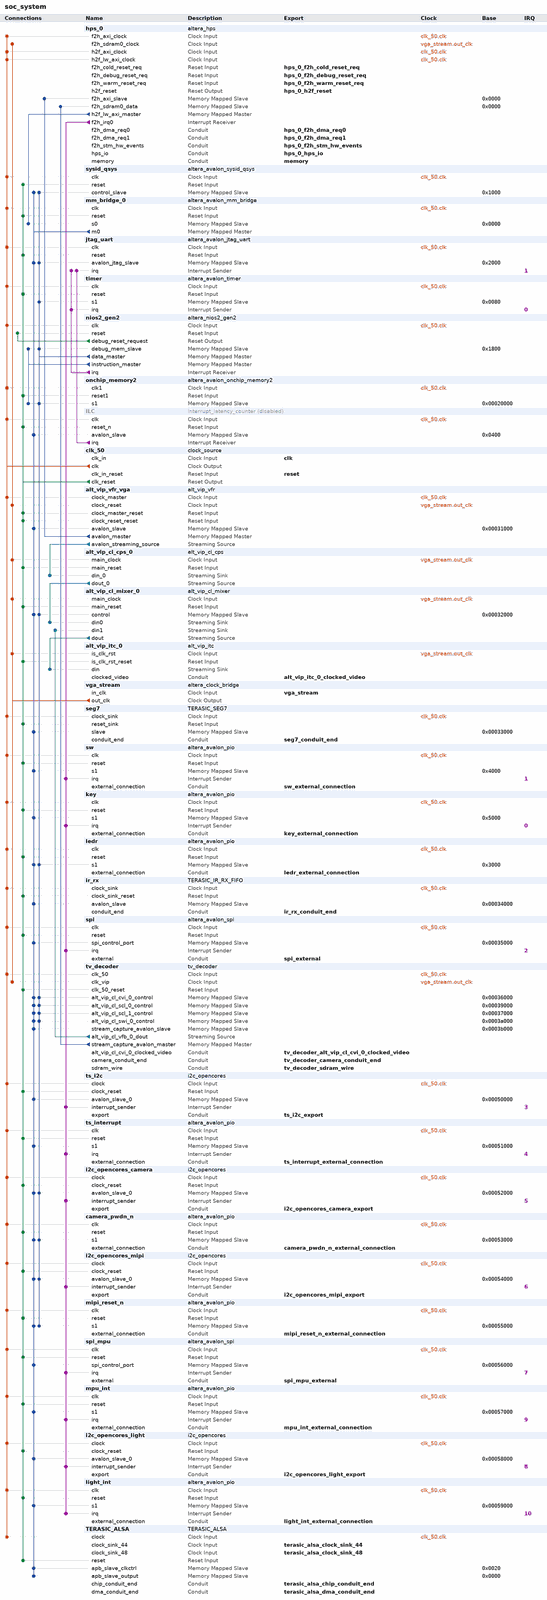
[diagram p0: system contents, whole]
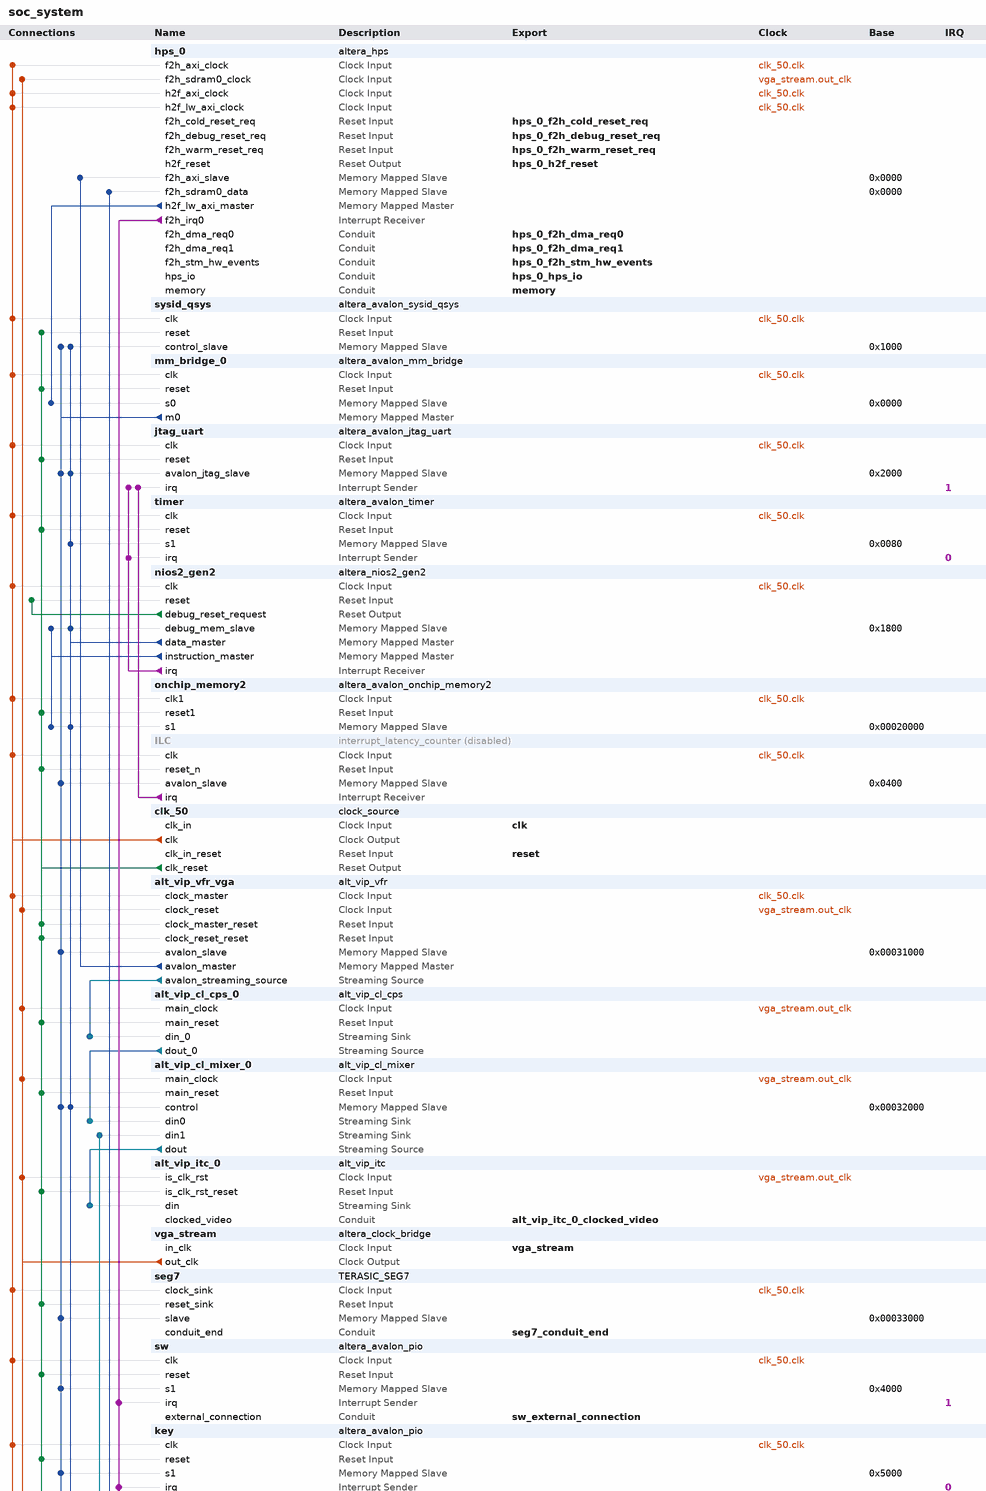
[diagram p1: system contents, upper part]
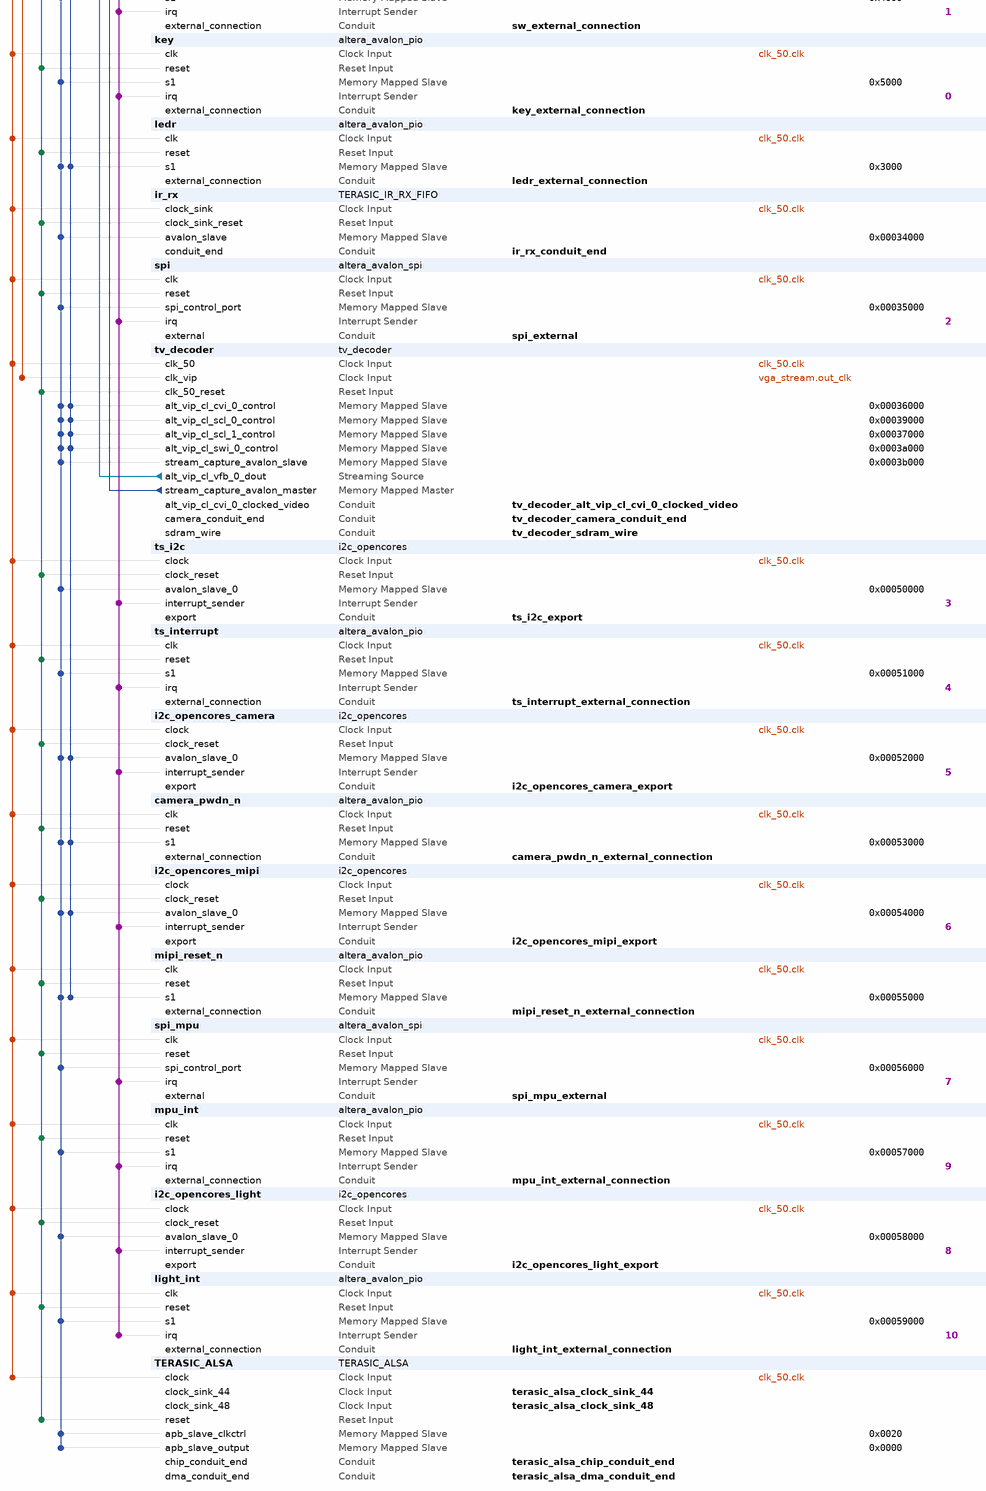
[diagram p2: system contents, lower part]
# Platform Designer (Qsys) system soc_system, Cyclone V 5CSXFC6D6F31C6
# Parameters at their usual value, and those the tool derives, are not listed.
package require -exact qsys 16.1
create_system soc_system
set_project_property DEVICE_FAMILY {Cyclone V}
set_project_property DEVICE 5CSXFC6D6F31C6

add_instance hps_0 altera_hps 16.1
set_instance_parameter_value hps_0 DMA_Enable Yes,Yes,No,No,No,No,No,No
set_instance_parameter_value hps_0 EMAC1_Mode RGMII
set_instance_parameter_value hps_0 EMAC1_PinMuxing {HPS I/O Set 0}
set_instance_parameter_value hps_0 F2SCLK_COLDRST_Enable true
set_instance_parameter_value hps_0 F2SCLK_DBGRST_Enable true
set_instance_parameter_value hps_0 F2SCLK_WARMRST_Enable true
set_instance_parameter_value hps_0 F2SDRAM_Type {Avalon-MM Bidirectional}
set_instance_parameter_value hps_0 F2SDRAM_Width 32
set_instance_parameter_value hps_0 F2SINTERRUPT_Enable true
set_instance_parameter_value hps_0 F2S_Width 3
set_instance_parameter_value hps_0 FPGA_PERIPHERAL_OUTPUT_CLOCK_FREQ_EMAC0_GTX_CLK 100
set_instance_parameter_value hps_0 FPGA_PERIPHERAL_OUTPUT_CLOCK_FREQ_EMAC0_MD_CLK 100.0
set_instance_parameter_value hps_0 FPGA_PERIPHERAL_OUTPUT_CLOCK_FREQ_EMAC1_GTX_CLK 100
set_instance_parameter_value hps_0 FPGA_PERIPHERAL_OUTPUT_CLOCK_FREQ_EMAC1_MD_CLK 100.0
set_instance_parameter_value hps_0 HPS_PROTOCOL DDR3
set_instance_parameter_value hps_0 I2C0_Mode I2C
set_instance_parameter_value hps_0 I2C0_PinMuxing {HPS I/O Set 0}
set_instance_parameter_value hps_0 I2C1_Mode I2C
set_instance_parameter_value hps_0 I2C1_PinMuxing {HPS I/O Set 0}
set_instance_parameter_value hps_0 LWH2F_Enable true
set_instance_parameter_value hps_0 MEM_BANKADDR_WIDTH 3
set_instance_parameter_value hps_0 MEM_CLK_FREQ 400.0
set_instance_parameter_value hps_0 MEM_COL_ADDR_WIDTH 10
set_instance_parameter_value hps_0 MEM_DQ_WIDTH 32
set_instance_parameter_value hps_0 MEM_DRV_STR RZQ/6
set_instance_parameter_value hps_0 MEM_ROW_ADDR_WIDTH 15
set_instance_parameter_value hps_0 MEM_RTT_NOM RZQ/6
set_instance_parameter_value hps_0 MEM_RTT_WR {Dynamic ODT off}
set_instance_parameter_value hps_0 MEM_TCL 7
set_instance_parameter_value hps_0 MEM_TFAW_NS 45.0
set_instance_parameter_value hps_0 MEM_TRAS_NS 36.0
set_instance_parameter_value hps_0 MEM_TRCD_NS 13.125
set_instance_parameter_value hps_0 MEM_TRFC_NS 300.0
set_instance_parameter_value hps_0 MEM_TRP_NS 13.125
set_instance_parameter_value hps_0 MEM_VENDOR Micron
set_instance_parameter_value hps_0 MEM_WTCL 7
set_instance_parameter_value hps_0 QSPI_Mode {1 SS}
set_instance_parameter_value hps_0 QSPI_PinMuxing {HPS I/O Set 0}
set_instance_parameter_value hps_0 REF_CLK_FREQ 25.0
set_instance_parameter_value hps_0 S2FCLK_USER2CLK 1
set_instance_parameter_value hps_0 S2F_Width 2
set_instance_parameter_value hps_0 SDIO_Mode {4-bit Data}
set_instance_parameter_value hps_0 SDIO_PinMuxing {HPS I/O Set 0}
set_instance_parameter_value hps_0 SPIM0_Mode {Single Slave Select}
set_instance_parameter_value hps_0 SPIM0_PinMuxing {HPS I/O Set 0}
set_instance_parameter_value hps_0 SPIM1_Mode {Single Slave Select}
set_instance_parameter_value hps_0 SPIM1_PinMuxing {HPS I/O Set 0}
set_instance_parameter_value hps_0 STM_Enable true
set_instance_parameter_value hps_0 TIMING_BOARD_AC_SKEW 0.02
set_instance_parameter_value hps_0 TIMING_BOARD_AC_TO_CK_SKEW 0.01
set_instance_parameter_value hps_0 TIMING_BOARD_DQ_TO_DQS_SKEW 0.05
set_instance_parameter_value hps_0 TIMING_BOARD_MAX_CK_DELAY 0.03
set_instance_parameter_value hps_0 TIMING_BOARD_MAX_DQS_DELAY 0.02
set_instance_parameter_value hps_0 TIMING_BOARD_SKEW_BETWEEN_DQS 0.06
set_instance_parameter_value hps_0 TIMING_BOARD_SKEW_CKDQS_DIMM_MAX 0.12
set_instance_parameter_value hps_0 TIMING_BOARD_SKEW_CKDQS_DIMM_MIN 0.06
set_instance_parameter_value hps_0 TIMING_BOARD_SKEW_WITHIN_DQS 0.01
set_instance_parameter_value hps_0 TIMING_TDH 65
set_instance_parameter_value hps_0 TIMING_TDQSCK 255
set_instance_parameter_value hps_0 TIMING_TDQSQ 125
set_instance_parameter_value hps_0 TIMING_TDS 30
set_instance_parameter_value hps_0 TIMING_TIH 140
set_instance_parameter_value hps_0 TIMING_TIS 190
set_instance_parameter_value hps_0 TIMING_TQSH 0.4
set_instance_parameter_value hps_0 UART0_Mode {No Flow Control}
set_instance_parameter_value hps_0 UART0_PinMuxing {HPS I/O Set 0}
set_instance_parameter_value hps_0 USB1_Mode SDR
set_instance_parameter_value hps_0 USB1_PinMuxing {HPS I/O Set 0}
set_instance_parameter_value hps_0 desired_cfg_clk_mhz 100.0
set_instance_parameter_value hps_0 desired_mpu_clk_mhz 925.0
set_instance_parameter_value hps_0 desired_qspi_clk_mhz 400.0
set_instance_parameter_value hps_0 use_default_mpu_clk false

add_instance sysid_qsys altera_avalon_sysid_qsys 16.1
set_instance_parameter_value sysid_qsys id -1395322110

add_instance mm_bridge_0 altera_avalon_mm_bridge 16.1
set_instance_parameter_value mm_bridge_0 ADDRESS_UNITS SYMBOLS
set_instance_parameter_value mm_bridge_0 ADDRESS_WIDTH 10
set_instance_parameter_value mm_bridge_0 DATA_WIDTH 32
set_instance_parameter_value mm_bridge_0 MAX_PENDING_RESPONSES 4
set_instance_parameter_value mm_bridge_0 USE_AUTO_ADDRESS_WIDTH 1

add_instance jtag_uart altera_avalon_jtag_uart 16.1
set_instance_parameter_value jtag_uart allowMultipleConnections true
set_instance_parameter_value jtag_uart readBufferDepth 512
set_instance_parameter_value jtag_uart simInteractiveOptions INTERACTIVE_ASCII_OUTPUT
set_instance_parameter_value jtag_uart writeBufferDepth 512

add_instance timer altera_avalon_timer 16.1
set_instance_parameter_value timer period 1
set_instance_parameter_value timer periodUnits MSEC

add_instance nios2_gen2 altera_nios2_gen2 16.1
set_instance_parameter_value nios2_gen2 dcache_size 2048
set_instance_parameter_value nios2_gen2 exceptionSlave onchip_memory2.s1
set_instance_parameter_value nios2_gen2 icache_size 4096
set_instance_parameter_value nios2_gen2 impl Fast
set_instance_parameter_value nios2_gen2 resetSlave onchip_memory2.s1

add_instance onchip_memory2 altera_avalon_onchip_memory2 16.1
set_instance_parameter_value onchip_memory2 dataWidth 64
set_instance_parameter_value onchip_memory2 dualPort false
set_instance_parameter_value onchip_memory2 initMemContent true
set_instance_parameter_value onchip_memory2 initializationFileName onchip_memory2
set_instance_parameter_value onchip_memory2 memorySize 65536

add_instance ILC interrupt_latency_counter 16.1
set_instance_property ILC ENABLED false

add_instance clk_50 clock_source 16.1
set_instance_parameter_value clk_50 clockFrequency 50000000

add_instance alt_vip_vfr_vga alt_vip_vfr 14.0
set_instance_parameter_value alt_vip_vfr_vga MAX_IMAGE_HEIGHT 480
set_instance_parameter_value alt_vip_vfr_vga MAX_IMAGE_WIDTH 800

add_instance alt_vip_cl_cps_0 alt_vip_cl_cps 16.1
set_instance_parameter_value alt_vip_cl_cps_0 BITS_PER_SYMBOL 8
set_instance_parameter_value alt_vip_cl_cps_0 EXTRA_PIPELINING 0
set_instance_parameter_value alt_vip_cl_cps_0 INPUT_0_COLOR_PLANES_ARE_IN_PARALLEL 1
set_instance_parameter_value alt_vip_cl_cps_0 INPUT_0_FIFO 0
set_instance_parameter_value alt_vip_cl_cps_0 INPUT_0_FIFO_SIZE 8
set_instance_parameter_value alt_vip_cl_cps_0 INPUT_0_NUMBER_OF_COLOR_PLANES 4
set_instance_parameter_value alt_vip_cl_cps_0 INPUT_0_PATTERN C0,C1,C2,no_used
set_instance_parameter_value alt_vip_cl_cps_0 INPUT_0_PIXELS_IN_PARALLEL 1
set_instance_parameter_value alt_vip_cl_cps_0 INPUT_0_TWO_PIXELS_PATTERN 0
set_instance_parameter_value alt_vip_cl_cps_0 INPUT_1_COLOR_PLANES_ARE_IN_PARALLEL 1
set_instance_parameter_value alt_vip_cl_cps_0 INPUT_1_FIFO 0
set_instance_parameter_value alt_vip_cl_cps_0 INPUT_1_FIFO_SIZE 8
set_instance_parameter_value alt_vip_cl_cps_0 INPUT_1_NUMBER_OF_COLOR_PLANES 3
set_instance_parameter_value alt_vip_cl_cps_0 INPUT_1_PATTERN C0,C1,C2
set_instance_parameter_value alt_vip_cl_cps_0 INPUT_1_PIXELS_IN_PARALLEL 1
set_instance_parameter_value alt_vip_cl_cps_0 INPUT_1_TWO_PIXELS_PATTERN 0
set_instance_parameter_value alt_vip_cl_cps_0 INPUT_VALIDATION 1
set_instance_parameter_value alt_vip_cl_cps_0 NUMBER_OF_INPUTS 1
set_instance_parameter_value alt_vip_cl_cps_0 NUMBER_OF_OUTPUTS 1
set_instance_parameter_value alt_vip_cl_cps_0 OUTPUT_0_COLOR_PLANES_ARE_IN_PARALLEL 1
set_instance_parameter_value alt_vip_cl_cps_0 OUTPUT_0_FIFO 0
set_instance_parameter_value alt_vip_cl_cps_0 OUTPUT_0_FIFO_SIZE 8
set_instance_parameter_value alt_vip_cl_cps_0 OUTPUT_0_NUMBER_OF_COLOR_PLANES 3
set_instance_parameter_value alt_vip_cl_cps_0 OUTPUT_0_PATTERN C0,C1,C2
set_instance_parameter_value alt_vip_cl_cps_0 OUTPUT_0_PIXELS_IN_PARALLEL 1
set_instance_parameter_value alt_vip_cl_cps_0 OUTPUT_0_TWO_PIXELS_PATTERN 0
set_instance_parameter_value alt_vip_cl_cps_0 OUTPUT_1_COLOR_PLANES_ARE_IN_PARALLEL 1
set_instance_parameter_value alt_vip_cl_cps_0 OUTPUT_1_FIFO 0
set_instance_parameter_value alt_vip_cl_cps_0 OUTPUT_1_FIFO_SIZE 8
set_instance_parameter_value alt_vip_cl_cps_0 OUTPUT_1_NUMBER_OF_COLOR_PLANES 3
set_instance_parameter_value alt_vip_cl_cps_0 OUTPUT_1_PATTERN C0,C1,C2
set_instance_parameter_value alt_vip_cl_cps_0 OUTPUT_1_PIXELS_IN_PARALLEL 1
set_instance_parameter_value alt_vip_cl_cps_0 OUTPUT_1_TWO_PIXELS_PATTERN 0
set_instance_parameter_value alt_vip_cl_cps_0 OUTPUT_VALIDATION 1
set_instance_parameter_value alt_vip_cl_cps_0 USER_PACKET_SUPPORT PASSTHROUGH
set_instance_parameter_value alt_vip_cl_cps_0 USER_PKT_0_TO_0 1
set_instance_parameter_value alt_vip_cl_cps_0 USER_PKT_0_TO_1 0
set_instance_parameter_value alt_vip_cl_cps_0 USER_PKT_1_TO_0 0
set_instance_parameter_value alt_vip_cl_cps_0 USER_PKT_1_TO_1 1

add_instance alt_vip_cl_mixer_0 alt_vip_cl_mixer 16.1
set_instance_parameter_value alt_vip_cl_mixer_0 ALPHA_ENABLE 0
set_instance_parameter_value alt_vip_cl_mixer_0 ALPHA_STREAMS_ENABLE 0
set_instance_parameter_value alt_vip_cl_mixer_0 BITS_PER_SYMBOL 8
set_instance_parameter_value alt_vip_cl_mixer_0 COLOR_PLANES_ARE_IN_PARALLEL 1
set_instance_parameter_value alt_vip_cl_mixer_0 COLOR_SPACE RGB
set_instance_parameter_value alt_vip_cl_mixer_0 FAMILY {Cyclone V}
set_instance_parameter_value alt_vip_cl_mixer_0 IS_422 1
set_instance_parameter_value alt_vip_cl_mixer_0 LAYER_POSITION_ENABLE 0
set_instance_parameter_value alt_vip_cl_mixer_0 MAX_HEIGHT 480
set_instance_parameter_value alt_vip_cl_mixer_0 MAX_WIDTH 800
set_instance_parameter_value alt_vip_cl_mixer_0 NO_OF_INPUTS 2
set_instance_parameter_value alt_vip_cl_mixer_0 NUMBER_OF_COLOR_PLANES 2
set_instance_parameter_value alt_vip_cl_mixer_0 PATTERN uniform
set_instance_parameter_value alt_vip_cl_mixer_0 PIPELINE_READY 0
set_instance_parameter_value alt_vip_cl_mixer_0 PIXELS_IN_PARALLEL 1
set_instance_parameter_value alt_vip_cl_mixer_0 UNIFORM_VALUE_BCR 128
set_instance_parameter_value alt_vip_cl_mixer_0 UNIFORM_VALUE_GCB 128
set_instance_parameter_value alt_vip_cl_mixer_0 UNIFORM_VALUE_RY 128
set_instance_parameter_value alt_vip_cl_mixer_0 USER_PACKET_FIFO_DEPTH 0
set_instance_parameter_value alt_vip_cl_mixer_0 USER_PACKET_SUPPORT PASSTHROUGH

add_instance alt_vip_itc_0 alt_vip_itc 14.0
set_instance_parameter_value alt_vip_itc_0 FIFO_DEPTH 8000
set_instance_parameter_value alt_vip_itc_0 H_ACTIVE_PIXELS 800
set_instance_parameter_value alt_vip_itc_0 H_BACK_PORCH 16
set_instance_parameter_value alt_vip_itc_0 H_FRONT_PORCH 210
set_instance_parameter_value alt_vip_itc_0 H_SYNC_LENGTH 30
set_instance_parameter_value alt_vip_itc_0 NUMBER_OF_COLOUR_PLANES 3
set_instance_parameter_value alt_vip_itc_0 THRESHOLD 7999
set_instance_parameter_value alt_vip_itc_0 V_ACTIVE_LINES 480
set_instance_parameter_value alt_vip_itc_0 V_BACK_PORCH 10
set_instance_parameter_value alt_vip_itc_0 V_FRONT_PORCH 22
set_instance_parameter_value alt_vip_itc_0 V_SYNC_LENGTH 13

add_instance vga_stream altera_clock_bridge 16.1
set_instance_parameter_value vga_stream DERIVED_CLOCK_RATE 0
set_instance_parameter_value vga_stream EXPLICIT_CLOCK_RATE 100000000

add_instance seg7 TERASIC_SEG7 1.0
set_instance_parameter_value seg7 ADDR_WIDTH 3
set_instance_parameter_value seg7 DEFAULT_ACTIVE 1
set_instance_parameter_value seg7 LOW_ACTIVE 1
set_instance_parameter_value seg7 SEG7_NUM 6

add_instance sw altera_avalon_pio 16.1
set_instance_parameter_value sw captureEdge true
set_instance_parameter_value sw direction Input
set_instance_parameter_value sw edgeType ANY
set_instance_parameter_value sw generateIRQ true
set_instance_parameter_value sw irqType EDGE
set_instance_parameter_value sw width 10

add_instance key altera_avalon_pio 16.1
set_instance_parameter_value key captureEdge true
set_instance_parameter_value key direction Input
set_instance_parameter_value key edgeType ANY
set_instance_parameter_value key generateIRQ true
set_instance_parameter_value key irqType EDGE
set_instance_parameter_value key width 4

add_instance ledr altera_avalon_pio 16.1
set_instance_parameter_value ledr direction Output
set_instance_parameter_value ledr width 10

add_instance ir_rx TERASIC_IR_RX_FIFO 1.0

add_instance spi altera_avalon_spi 16.1
set_instance_parameter_value spi clockPolarity 1
set_instance_parameter_value spi dataWidth 16
set_instance_parameter_value spi masterSPI true
set_instance_parameter_value spi numberOfSlaves 1
set_instance_parameter_value spi targetClockRate 20000000

add_instance tv_decoder tv_decoder 1.0

add_instance ts_i2c i2c_opencores 12.0

add_instance ts_interrupt altera_avalon_pio 16.1
set_instance_parameter_value ts_interrupt captureEdge true
set_instance_parameter_value ts_interrupt direction Input
set_instance_parameter_value ts_interrupt edgeType FALLING
set_instance_parameter_value ts_interrupt generateIRQ true
set_instance_parameter_value ts_interrupt irqType EDGE
set_instance_parameter_value ts_interrupt width 1

add_instance i2c_opencores_camera i2c_opencores 12.0

add_instance camera_pwdn_n altera_avalon_pio 16.1
set_instance_parameter_value camera_pwdn_n direction Output
set_instance_parameter_value camera_pwdn_n resetValue 1
set_instance_parameter_value camera_pwdn_n width 1

add_instance i2c_opencores_mipi i2c_opencores 12.0

add_instance mipi_reset_n altera_avalon_pio 16.1
set_instance_parameter_value mipi_reset_n direction Output
set_instance_parameter_value mipi_reset_n resetValue 1
set_instance_parameter_value mipi_reset_n width 1

add_instance spi_mpu altera_avalon_spi 16.1
set_instance_parameter_value spi_mpu clockPhase 1
set_instance_parameter_value spi_mpu clockPolarity 1
set_instance_parameter_value spi_mpu dataWidth 8
set_instance_parameter_value spi_mpu masterSPI true
set_instance_parameter_value spi_mpu numberOfSlaves 1
set_instance_parameter_value spi_mpu targetClockRate 1000000

add_instance mpu_int altera_avalon_pio 16.1
set_instance_parameter_value mpu_int captureEdge true
set_instance_parameter_value mpu_int direction Input
set_instance_parameter_value mpu_int generateIRQ true
set_instance_parameter_value mpu_int irqType EDGE
set_instance_parameter_value mpu_int width 1

add_instance i2c_opencores_light i2c_opencores 12.0

add_instance light_int altera_avalon_pio 16.1
set_instance_parameter_value light_int captureEdge true
set_instance_parameter_value light_int direction Input
set_instance_parameter_value light_int generateIRQ true
set_instance_parameter_value light_int irqType EDGE
set_instance_parameter_value light_int width 1

add_instance TERASIC_ALSA TERASIC_ALSA 1.0

# connections
add_connection clk_50.clk alt_vip_vfr_vga.clock_master clock
add_connection clk_50.clk camera_pwdn_n.clk clock
add_connection clk_50.clk hps_0.f2h_axi_clock clock
add_connection clk_50.clk hps_0.h2f_axi_clock clock
add_connection clk_50.clk hps_0.h2f_lw_axi_clock clock
add_connection clk_50.clk i2c_opencores_camera.clock clock
add_connection clk_50.clk i2c_opencores_light.clock clock
add_connection clk_50.clk i2c_opencores_mipi.clock clock
add_connection clk_50.clk ILC.clk clock
add_connection clk_50.clk ir_rx.clock_sink clock
add_connection clk_50.clk jtag_uart.clk clock
add_connection clk_50.clk key.clk clock
add_connection clk_50.clk ledr.clk clock
add_connection clk_50.clk light_int.clk clock
add_connection clk_50.clk mipi_reset_n.clk clock
add_connection clk_50.clk mm_bridge_0.clk clock
add_connection clk_50.clk mpu_int.clk clock
add_connection clk_50.clk nios2_gen2.clk clock
add_connection clk_50.clk onchip_memory2.clk1 clock
add_connection clk_50.clk seg7.clock_sink clock
add_connection clk_50.clk spi.clk clock
add_connection clk_50.clk spi_mpu.clk clock
add_connection clk_50.clk sw.clk clock
add_connection clk_50.clk sysid_qsys.clk clock
add_connection clk_50.clk TERASIC_ALSA.clock clock
add_connection clk_50.clk timer.clk clock
add_connection clk_50.clk ts_i2c.clock clock
add_connection clk_50.clk ts_interrupt.clk clock
add_connection clk_50.clk tv_decoder.clk_50 clock
add_connection vga_stream.out_clk alt_vip_cl_cps_0.main_clock clock
add_connection vga_stream.out_clk alt_vip_cl_mixer_0.main_clock clock
add_connection vga_stream.out_clk alt_vip_itc_0.is_clk_rst clock
add_connection vga_stream.out_clk alt_vip_vfr_vga.clock_reset clock
add_connection vga_stream.out_clk hps_0.f2h_sdram0_clock clock
add_connection vga_stream.out_clk tv_decoder.clk_vip clock
add_connection clk_50.clk_reset alt_vip_cl_cps_0.main_reset reset
add_connection clk_50.clk_reset alt_vip_cl_mixer_0.main_reset reset
add_connection clk_50.clk_reset alt_vip_itc_0.is_clk_rst_reset reset
add_connection clk_50.clk_reset alt_vip_vfr_vga.clock_master_reset reset
add_connection clk_50.clk_reset alt_vip_vfr_vga.clock_reset_reset reset
add_connection clk_50.clk_reset camera_pwdn_n.reset reset
add_connection clk_50.clk_reset i2c_opencores_camera.clock_reset reset
add_connection clk_50.clk_reset i2c_opencores_light.clock_reset reset
add_connection clk_50.clk_reset i2c_opencores_mipi.clock_reset reset
add_connection clk_50.clk_reset ILC.reset_n reset
add_connection clk_50.clk_reset ir_rx.clock_sink_reset reset
add_connection clk_50.clk_reset jtag_uart.reset reset
add_connection clk_50.clk_reset key.reset reset
add_connection clk_50.clk_reset ledr.reset reset
add_connection clk_50.clk_reset light_int.reset reset
add_connection clk_50.clk_reset mipi_reset_n.reset reset
add_connection clk_50.clk_reset mm_bridge_0.reset reset
add_connection clk_50.clk_reset mpu_int.reset reset
add_connection clk_50.clk_reset onchip_memory2.reset1 reset
add_connection clk_50.clk_reset seg7.reset_sink reset
add_connection clk_50.clk_reset spi.reset reset
add_connection clk_50.clk_reset spi_mpu.reset reset
add_connection clk_50.clk_reset sw.reset reset
add_connection clk_50.clk_reset sysid_qsys.reset reset
add_connection clk_50.clk_reset TERASIC_ALSA.reset reset
add_connection clk_50.clk_reset timer.reset reset
add_connection clk_50.clk_reset ts_i2c.clock_reset reset
add_connection clk_50.clk_reset ts_interrupt.reset reset
add_connection clk_50.clk_reset tv_decoder.clk_50_reset reset
add_connection nios2_gen2.debug_reset_request nios2_gen2.reset reset
add_connection alt_vip_vfr_vga.avalon_master hps_0.f2h_axi_slave avalon
set_connection_parameter_value alt_vip_vfr_vga.avalon_master/hps_0.f2h_axi_slave baseAddress 0x0000
add_connection hps_0.h2f_lw_axi_master mm_bridge_0.s0 avalon
set_connection_parameter_value hps_0.h2f_lw_axi_master/mm_bridge_0.s0 baseAddress 0x0000
add_connection mm_bridge_0.m0 alt_vip_cl_mixer_0.control avalon
set_connection_parameter_value mm_bridge_0.m0/alt_vip_cl_mixer_0.control baseAddress 0x00032000
add_connection mm_bridge_0.m0 alt_vip_vfr_vga.avalon_slave avalon
set_connection_parameter_value mm_bridge_0.m0/alt_vip_vfr_vga.avalon_slave baseAddress 0x00031000
add_connection mm_bridge_0.m0 camera_pwdn_n.s1 avalon
set_connection_parameter_value mm_bridge_0.m0/camera_pwdn_n.s1 baseAddress 0x00053000
add_connection mm_bridge_0.m0 i2c_opencores_camera.avalon_slave_0 avalon
set_connection_parameter_value mm_bridge_0.m0/i2c_opencores_camera.avalon_slave_0 baseAddress 0x00052000
add_connection mm_bridge_0.m0 i2c_opencores_light.avalon_slave_0 avalon
set_connection_parameter_value mm_bridge_0.m0/i2c_opencores_light.avalon_slave_0 baseAddress 0x00058000
add_connection mm_bridge_0.m0 i2c_opencores_mipi.avalon_slave_0 avalon
set_connection_parameter_value mm_bridge_0.m0/i2c_opencores_mipi.avalon_slave_0 baseAddress 0x00054000
add_connection mm_bridge_0.m0 ILC.avalon_slave avalon
set_connection_parameter_value mm_bridge_0.m0/ILC.avalon_slave baseAddress 0x0400
add_connection mm_bridge_0.m0 ir_rx.avalon_slave avalon
set_connection_parameter_value mm_bridge_0.m0/ir_rx.avalon_slave baseAddress 0x00034000
add_connection mm_bridge_0.m0 jtag_uart.avalon_jtag_slave avalon
set_connection_parameter_value mm_bridge_0.m0/jtag_uart.avalon_jtag_slave baseAddress 0x2000
add_connection mm_bridge_0.m0 key.s1 avalon
set_connection_parameter_value mm_bridge_0.m0/key.s1 baseAddress 0x5000
add_connection mm_bridge_0.m0 ledr.s1 avalon
set_connection_parameter_value mm_bridge_0.m0/ledr.s1 baseAddress 0x3000
add_connection mm_bridge_0.m0 light_int.s1 avalon
set_connection_parameter_value mm_bridge_0.m0/light_int.s1 baseAddress 0x00059000
add_connection mm_bridge_0.m0 mipi_reset_n.s1 avalon
set_connection_parameter_value mm_bridge_0.m0/mipi_reset_n.s1 baseAddress 0x00055000
add_connection mm_bridge_0.m0 mpu_int.s1 avalon
set_connection_parameter_value mm_bridge_0.m0/mpu_int.s1 baseAddress 0x00057000
add_connection mm_bridge_0.m0 seg7.slave avalon
set_connection_parameter_value mm_bridge_0.m0/seg7.slave baseAddress 0x00033000
add_connection mm_bridge_0.m0 spi.spi_control_port avalon
set_connection_parameter_value mm_bridge_0.m0/spi.spi_control_port baseAddress 0x00035000
add_connection mm_bridge_0.m0 spi_mpu.spi_control_port avalon
set_connection_parameter_value mm_bridge_0.m0/spi_mpu.spi_control_port baseAddress 0x00056000
add_connection mm_bridge_0.m0 sw.s1 avalon
set_connection_parameter_value mm_bridge_0.m0/sw.s1 baseAddress 0x4000
add_connection mm_bridge_0.m0 sysid_qsys.control_slave avalon
set_connection_parameter_value mm_bridge_0.m0/sysid_qsys.control_slave baseAddress 0x1000
add_connection mm_bridge_0.m0 TERASIC_ALSA.apb_slave_clkctrl avalon
set_connection_parameter_value mm_bridge_0.m0/TERASIC_ALSA.apb_slave_clkctrl baseAddress 0x0020
add_connection mm_bridge_0.m0 TERASIC_ALSA.apb_slave_output avalon
set_connection_parameter_value mm_bridge_0.m0/TERASIC_ALSA.apb_slave_output baseAddress 0x0000
add_connection mm_bridge_0.m0 ts_i2c.avalon_slave_0 avalon
set_connection_parameter_value mm_bridge_0.m0/ts_i2c.avalon_slave_0 baseAddress 0x00050000
add_connection mm_bridge_0.m0 ts_interrupt.s1 avalon
set_connection_parameter_value mm_bridge_0.m0/ts_interrupt.s1 baseAddress 0x00051000
add_connection mm_bridge_0.m0 tv_decoder.alt_vip_cl_cvi_0_control avalon
set_connection_parameter_value mm_bridge_0.m0/tv_decoder.alt_vip_cl_cvi_0_control baseAddress 0x00036000
add_connection mm_bridge_0.m0 tv_decoder.alt_vip_cl_scl_0_control avalon
set_connection_parameter_value mm_bridge_0.m0/tv_decoder.alt_vip_cl_scl_0_control baseAddress 0x00039000
add_connection mm_bridge_0.m0 tv_decoder.alt_vip_cl_scl_1_control avalon
set_connection_parameter_value mm_bridge_0.m0/tv_decoder.alt_vip_cl_scl_1_control baseAddress 0x00037000
add_connection mm_bridge_0.m0 tv_decoder.alt_vip_cl_swi_0_control avalon
set_connection_parameter_value mm_bridge_0.m0/tv_decoder.alt_vip_cl_swi_0_control baseAddress 0x0003a000
add_connection mm_bridge_0.m0 tv_decoder.stream_capture_avalon_slave avalon
set_connection_parameter_value mm_bridge_0.m0/tv_decoder.stream_capture_avalon_slave baseAddress 0x0003b000
add_connection nios2_gen2.data_master alt_vip_cl_mixer_0.control avalon
set_connection_parameter_value nios2_gen2.data_master/alt_vip_cl_mixer_0.control baseAddress 0x00032000
add_connection nios2_gen2.data_master camera_pwdn_n.s1 avalon
set_connection_parameter_value nios2_gen2.data_master/camera_pwdn_n.s1 baseAddress 0x00053000
add_connection nios2_gen2.data_master i2c_opencores_camera.avalon_slave_0 avalon
set_connection_parameter_value nios2_gen2.data_master/i2c_opencores_camera.avalon_slave_0 baseAddress 0x00052000
add_connection nios2_gen2.data_master i2c_opencores_mipi.avalon_slave_0 avalon
set_connection_parameter_value nios2_gen2.data_master/i2c_opencores_mipi.avalon_slave_0 baseAddress 0x00054000
add_connection nios2_gen2.data_master jtag_uart.avalon_jtag_slave avalon
set_connection_parameter_value nios2_gen2.data_master/jtag_uart.avalon_jtag_slave baseAddress 0x2000
add_connection nios2_gen2.data_master ledr.s1 avalon
set_connection_parameter_value nios2_gen2.data_master/ledr.s1 baseAddress 0x3000
add_connection nios2_gen2.data_master mipi_reset_n.s1 avalon
set_connection_parameter_value nios2_gen2.data_master/mipi_reset_n.s1 baseAddress 0x00055000
add_connection nios2_gen2.data_master nios2_gen2.debug_mem_slave avalon
set_connection_parameter_value nios2_gen2.data_master/nios2_gen2.debug_mem_slave baseAddress 0x1800
add_connection nios2_gen2.data_master onchip_memory2.s1 avalon
set_connection_parameter_value nios2_gen2.data_master/onchip_memory2.s1 baseAddress 0x00020000
add_connection nios2_gen2.data_master sysid_qsys.control_slave avalon
set_connection_parameter_value nios2_gen2.data_master/sysid_qsys.control_slave baseAddress 0x1000
add_connection nios2_gen2.data_master timer.s1 avalon
set_connection_parameter_value nios2_gen2.data_master/timer.s1 baseAddress 0x0080
add_connection nios2_gen2.data_master tv_decoder.alt_vip_cl_cvi_0_control avalon
set_connection_parameter_value nios2_gen2.data_master/tv_decoder.alt_vip_cl_cvi_0_control baseAddress 0x00036000
add_connection nios2_gen2.data_master tv_decoder.alt_vip_cl_scl_0_control avalon
set_connection_parameter_value nios2_gen2.data_master/tv_decoder.alt_vip_cl_scl_0_control baseAddress 0x00039000
add_connection nios2_gen2.data_master tv_decoder.alt_vip_cl_scl_1_control avalon
set_connection_parameter_value nios2_gen2.data_master/tv_decoder.alt_vip_cl_scl_1_control baseAddress 0x00037000
add_connection nios2_gen2.data_master tv_decoder.alt_vip_cl_swi_0_control avalon
set_connection_parameter_value nios2_gen2.data_master/tv_decoder.alt_vip_cl_swi_0_control baseAddress 0x0003a000
add_connection nios2_gen2.instruction_master nios2_gen2.debug_mem_slave avalon
set_connection_parameter_value nios2_gen2.instruction_master/nios2_gen2.debug_mem_slave baseAddress 0x1800
add_connection nios2_gen2.instruction_master onchip_memory2.s1 avalon
set_connection_parameter_value nios2_gen2.instruction_master/onchip_memory2.s1 baseAddress 0x00020000
add_connection tv_decoder.stream_capture_avalon_master hps_0.f2h_sdram0_data avalon
set_connection_parameter_value tv_decoder.stream_capture_avalon_master/hps_0.f2h_sdram0_data baseAddress 0x0000
add_connection alt_vip_cl_cps_0.dout_0 alt_vip_cl_mixer_0.din0 avalon_streaming
add_connection alt_vip_cl_mixer_0.dout alt_vip_itc_0.din avalon_streaming
add_connection alt_vip_vfr_vga.avalon_streaming_source alt_vip_cl_cps_0.din_0 avalon_streaming
add_connection tv_decoder.alt_vip_cl_vfb_0_dout alt_vip_cl_mixer_0.din1 avalon_streaming
add_connection hps_0.f2h_irq0 i2c_opencores_camera.interrupt_sender interrupt
set_connection_parameter_value hps_0.f2h_irq0/i2c_opencores_camera.interrupt_sender irqNumber 5
add_connection hps_0.f2h_irq0 i2c_opencores_light.interrupt_sender interrupt
set_connection_parameter_value hps_0.f2h_irq0/i2c_opencores_light.interrupt_sender irqNumber 8
add_connection hps_0.f2h_irq0 i2c_opencores_mipi.interrupt_sender interrupt
set_connection_parameter_value hps_0.f2h_irq0/i2c_opencores_mipi.interrupt_sender irqNumber 6
add_connection hps_0.f2h_irq0 key.irq interrupt
set_connection_parameter_value hps_0.f2h_irq0/key.irq irqNumber 0
add_connection hps_0.f2h_irq0 light_int.irq interrupt
set_connection_parameter_value hps_0.f2h_irq0/light_int.irq irqNumber 10
add_connection hps_0.f2h_irq0 mpu_int.irq interrupt
set_connection_parameter_value hps_0.f2h_irq0/mpu_int.irq irqNumber 9
add_connection hps_0.f2h_irq0 spi.irq interrupt
set_connection_parameter_value hps_0.f2h_irq0/spi.irq irqNumber 2
add_connection hps_0.f2h_irq0 spi_mpu.irq interrupt
set_connection_parameter_value hps_0.f2h_irq0/spi_mpu.irq irqNumber 7
add_connection hps_0.f2h_irq0 sw.irq interrupt
set_connection_parameter_value hps_0.f2h_irq0/sw.irq irqNumber 1
add_connection hps_0.f2h_irq0 ts_i2c.interrupt_sender interrupt
set_connection_parameter_value hps_0.f2h_irq0/ts_i2c.interrupt_sender irqNumber 3
add_connection hps_0.f2h_irq0 ts_interrupt.irq interrupt
set_connection_parameter_value hps_0.f2h_irq0/ts_interrupt.irq irqNumber 4
add_connection ILC.irq jtag_uart.irq interrupt
set_connection_parameter_value ILC.irq/jtag_uart.irq irqNumber 0
add_connection nios2_gen2.irq jtag_uart.irq interrupt
set_connection_parameter_value nios2_gen2.irq/jtag_uart.irq irqNumber 1
add_connection nios2_gen2.irq timer.irq interrupt
set_connection_parameter_value nios2_gen2.irq/timer.irq irqNumber 0

# exported interfaces
add_interface alt_vip_itc_0_clocked_video conduit end
set_interface_property alt_vip_itc_0_clocked_video EXPORT_OF alt_vip_itc_0.clocked_video
add_interface camera_pwdn_n_external_connection conduit end
set_interface_property camera_pwdn_n_external_connection EXPORT_OF camera_pwdn_n.external_connection
add_interface clk clock sink
set_interface_property clk EXPORT_OF clk_50.clk_in
add_interface hps_0_f2h_cold_reset_req reset sink
set_interface_property hps_0_f2h_cold_reset_req EXPORT_OF hps_0.f2h_cold_reset_req
add_interface hps_0_f2h_debug_reset_req reset sink
set_interface_property hps_0_f2h_debug_reset_req EXPORT_OF hps_0.f2h_debug_reset_req
add_interface hps_0_f2h_dma_req0 conduit end
set_interface_property hps_0_f2h_dma_req0 EXPORT_OF hps_0.f2h_dma_req0
add_interface hps_0_f2h_dma_req1 conduit end
set_interface_property hps_0_f2h_dma_req1 EXPORT_OF hps_0.f2h_dma_req1
add_interface hps_0_f2h_stm_hw_events conduit end
set_interface_property hps_0_f2h_stm_hw_events EXPORT_OF hps_0.f2h_stm_hw_events
add_interface hps_0_f2h_warm_reset_req reset sink
set_interface_property hps_0_f2h_warm_reset_req EXPORT_OF hps_0.f2h_warm_reset_req
add_interface hps_0_h2f_reset reset source
set_interface_property hps_0_h2f_reset EXPORT_OF hps_0.h2f_reset
add_interface hps_0_hps_io conduit end
set_interface_property hps_0_hps_io EXPORT_OF hps_0.hps_io
add_interface i2c_opencores_camera_export conduit end
set_interface_property i2c_opencores_camera_export EXPORT_OF i2c_opencores_camera.export
add_interface i2c_opencores_light_export conduit end
set_interface_property i2c_opencores_light_export EXPORT_OF i2c_opencores_light.export
add_interface i2c_opencores_mipi_export conduit end
set_interface_property i2c_opencores_mipi_export EXPORT_OF i2c_opencores_mipi.export
add_interface ir_rx_conduit_end conduit end
set_interface_property ir_rx_conduit_end EXPORT_OF ir_rx.conduit_end
add_interface key_external_connection conduit end
set_interface_property key_external_connection EXPORT_OF key.external_connection
add_interface ledr_external_connection conduit end
set_interface_property ledr_external_connection EXPORT_OF ledr.external_connection
add_interface light_int_external_connection conduit end
set_interface_property light_int_external_connection EXPORT_OF light_int.external_connection
add_interface memory conduit end
set_interface_property memory EXPORT_OF hps_0.memory
add_interface mipi_reset_n_external_connection conduit end
set_interface_property mipi_reset_n_external_connection EXPORT_OF mipi_reset_n.external_connection
add_interface mpu_int_external_connection conduit end
set_interface_property mpu_int_external_connection EXPORT_OF mpu_int.external_connection
add_interface reset reset sink
set_interface_property reset EXPORT_OF clk_50.clk_in_reset
add_interface seg7_conduit_end conduit end
set_interface_property seg7_conduit_end EXPORT_OF seg7.conduit_end
add_interface spi_external conduit end
set_interface_property spi_external EXPORT_OF spi.external
add_interface spi_mpu_external conduit end
set_interface_property spi_mpu_external EXPORT_OF spi_mpu.external
add_interface sw_external_connection conduit end
set_interface_property sw_external_connection EXPORT_OF sw.external_connection
add_interface terasic_alsa_chip_conduit_end conduit end
set_interface_property terasic_alsa_chip_conduit_end EXPORT_OF TERASIC_ALSA.chip_conduit_end
add_interface terasic_alsa_clock_sink_44 clock sink
set_interface_property terasic_alsa_clock_sink_44 EXPORT_OF TERASIC_ALSA.clock_sink_44
add_interface terasic_alsa_clock_sink_48 clock sink
set_interface_property terasic_alsa_clock_sink_48 EXPORT_OF TERASIC_ALSA.clock_sink_48
add_interface terasic_alsa_dma_conduit_end conduit end
set_interface_property terasic_alsa_dma_conduit_end EXPORT_OF TERASIC_ALSA.dma_conduit_end
add_interface ts_i2c_export conduit end
set_interface_property ts_i2c_export EXPORT_OF ts_i2c.export
add_interface ts_interrupt_external_connection conduit end
set_interface_property ts_interrupt_external_connection EXPORT_OF ts_interrupt.external_connection
add_interface tv_decoder_alt_vip_cl_cvi_0_clocked_video conduit end
set_interface_property tv_decoder_alt_vip_cl_cvi_0_clocked_video EXPORT_OF tv_decoder.alt_vip_cl_cvi_0_clocked_video
add_interface tv_decoder_camera_conduit_end conduit end
set_interface_property tv_decoder_camera_conduit_end EXPORT_OF tv_decoder.camera_conduit_end
add_interface tv_decoder_sdram_wire conduit end
set_interface_property tv_decoder_sdram_wire EXPORT_OF tv_decoder.sdram_wire
add_interface vga_stream clock sink
set_interface_property vga_stream EXPORT_OF vga_stream.in_clk

set_interconnect_requirement {$system} qsys_mm.clockCrossingAdapter HANDSHAKE
set_interconnect_requirement {$system} qsys_mm.maxAdditionalLatency 1

save_system soc_system.qsys
